# Altium schematic sheet MCU.SchDoc
size A3; SheetNumber: 3; SheetTotal: 5
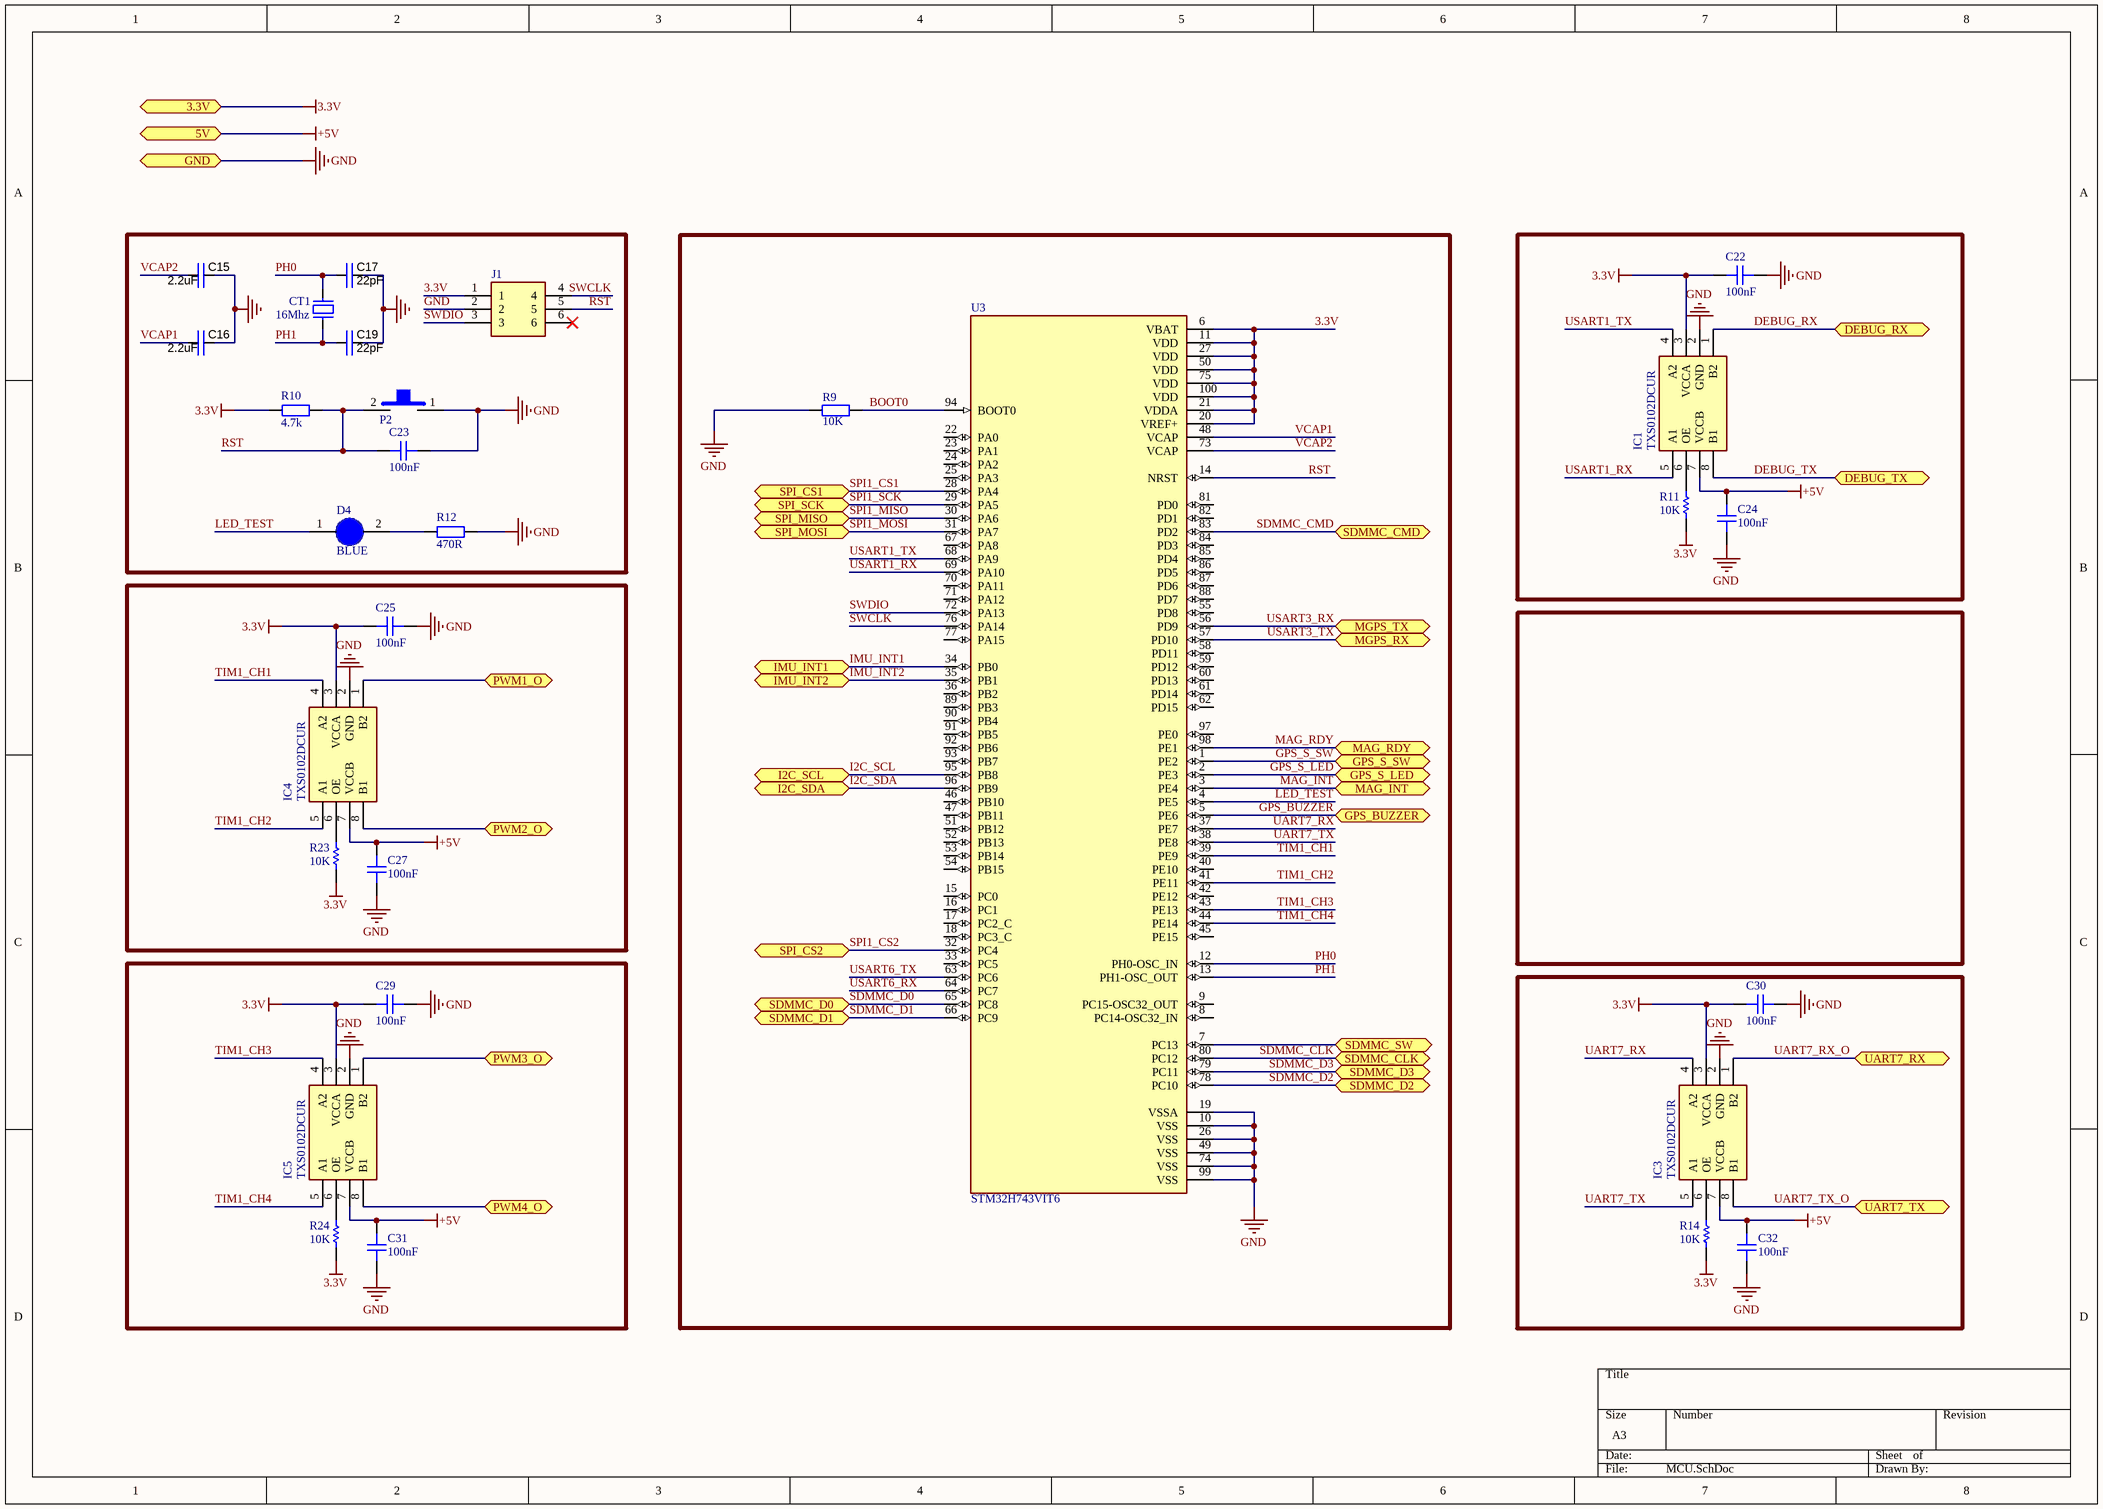
[diagram p0: MCU.SchDoc]

## Parts
C15  value 2.2uF  [CAPC-0402 (0506)]  (hidden comment: Tụ gốm)
C16  value 2.2uF  [CAPC-0402 (0506)]  (hidden comment: Tụ gốm)
C17  22pF  [CAPC-0402 (1005)]
C19  22pF  [CAPC-0402 (1005)]
C22  100nF  [CAP_0402]
C23  100nF  [CAP_0402]
C24  100nF  [CAP_0402]
C25  100nF  [CAP_0402]
C27  100nF  [CAP_0402]
C29  100nF  [CAP_0402]
C30  100nF  [CAP_0402]
C31  100nF  [CAP_0402]
C32  100nF  [CAP_0402]
CT1  16Mhz  [CRYSTAL-SMD5032]
D4  BLUE  [LED_0603_BLUE]
IC1  TXS0102DCUR  [TXS0102DCUR]
IC3  TXS0102DCUR  [TXS0102DCUR]
IC4  TXS0102DCUR  [TXS0102DCUR]
IC5  TXS0102DCUR  [TXS0102DCUR]
J1  SM06B-SRSS-TB__LF__SN_  [SM06B-SRSS-TB]  (value not drawn)
P2  (no value)  [SW 2P SMD]
R9  10K  [RESC-0402 (1005)]
R10  4.7k  [RESC-0402 (1005)]
R11  10K  [RESC-0402 (1005)]
R12  470R  [RESC-0402 (1005)]
R14  10K  [RESC-0402 (1005)]
R23  10K  [RESC-0402 (1005)]
R24  10K  [RESC-0402 (1005)]
U3  STM32H743VIT6  [QFP50P1600X1600X160-100N]

## Ports
3.3V (bidir), 5V (bidir), DEBUG_RX (bidir), DEBUG_TX (bidir), GND (bidir), GPS_BUZZER (bidir), GPS_S_LED (bidir), GPS_S_SW (bidir), I2C_SCL (bidir), I2C_SDA (bidir), IMU_INT1 (bidir), IMU_INT2 (bidir), MAG_INT (bidir), MAG_RDY (bidir), MGPS_RX (bidir), MGPS_TX (bidir), PWM1_O (bidir), PWM2_O (bidir), PWM3_O (bidir), PWM4_O (bidir), SDMMC_CLK (bidir), SDMMC_CMD (bidir), SDMMC_D0 (bidir), SDMMC_D1 (bidir), SDMMC_D2 (bidir), SDMMC_D3 (bidir), SDMMC_SW (bidir), SPI_CS1 (bidir), SPI_CS2 (bidir), SPI_MISO (bidir), SPI_MOSI (bidir), SPI_SCK (bidir), UART7_RX (bidir), UART7_TX (bidir)

## Nets
3.3V: C22.2 C25.2 C29.2 C30.2 IC1.3(VCCA) IC3.3(VCCA) IC4.3(VCCA) IC5.3(VCCA) J1.1 R10.2 R11.1 R14.1 R23.1 R24.1 U3.6(VBAT) U3.11(VDD) U3.20(VREF+) U3.21(VDDA) U3.27(VDD) U3.50(VDD) U3.75(VDD) U3.100(VDD) ; port 3.3V
+5V: C24.2 C27.2 C31.2 C32.2 IC1.7(VCCB) IC3.7(VCCB) IC4.7(VCCB) IC5.7(VCCB) ; port 5V
GND: C15.2 C16.2 C17.2 C19.2 C22.1 C23.1 C24.1 C25.1 C27.1 C29.1 C30.1 C31.1 C32.1 IC1.2(GND) IC3.2(GND) IC4.2(GND) IC5.2(GND) J1.2 P2.1 R9.1 R12.1 U3.10(VSS) U3.19(VSSA) U3.26(VSS) U3.49(VSS) U3.74(VSS) U3.99(VSS) ; port GND
BOOT0: R9.2 U3.94(BOOT0)
DEBUG_RX: IC1.1(B2) ; port DEBUG_RX
DEBUG_TX: IC1.8(B1) ; port DEBUG_TX
GPS_BUZZER: U3.5(PE6) ; port GPS_BUZZER
GPS_S_LED: U3.2(PE3) ; port GPS_S_LED
GPS_S_SW: U3.1(PE2) ; port GPS_S_SW
I2C_SCL: U3.95(PB8) ; port I2C_SCL
I2C_SDA: U3.96(PB9) ; port I2C_SDA
IMU_INT1: U3.34(PB0) ; port IMU_INT1
IMU_INT2: U3.35(PB1) ; port IMU_INT2
LED_TEST: D4.1(A) U3.4(PE5)
MAG_INT: U3.3(PE4) ; port MAG_INT
MAG_RDY: U3.98(PE1) ; port MAG_RDY
PH0: C17.1 CT1.2 U3.12(PH0-OSC_IN)
PH1: C19.1 CT1.1 U3.13(PH1-OSC_OUT)
PWM1_O: IC4.1(B2) ; port PWM1_O
PWM2_O: IC4.8(B1) ; port PWM2_O
PWM3_O: IC5.1(B2) ; port PWM3_O
PWM4_O: IC5.8(B1) ; port PWM4_O
RST: C23.2 J1.5 P2.2 R10.1 U3.14(NRST)
SDMMC_CLK: U3.80(PC12) ; port SDMMC_CLK
SDMMC_CMD: U3.83(PD2) ; port SDMMC_CMD
SDMMC_D0: U3.65(PC8) ; port SDMMC_D0
SDMMC_D1: U3.66(PC9) ; port SDMMC_D1
SDMMC_D2: U3.78(PC10) ; port SDMMC_D2
SDMMC_D3: U3.79(PC11) ; port SDMMC_D3
SDMMC_SW: U3.7(PC13) ; port SDMMC_SW
SPI1_CS1: U3.28(PA4) ; port SPI_CS1
SPI1_CS2: U3.32(PC4) ; port SPI_CS2
SPI1_MISO: U3.30(PA6) ; port SPI_MISO
SPI1_MOSI: U3.31(PA7) ; port SPI_MOSI
SPI1_SCK: U3.29(PA5) ; port SPI_SCK
SWCLK: J1.4 U3.76(PA14)
SWDIO: J1.3 U3.72(PA13)
TIM1_CH1: IC4.4(A2) U3.39(PE9)
TIM1_CH2: IC4.5(A1) U3.41(PE11)
TIM1_CH3: IC5.4(A2) U3.43(PE13)
TIM1_CH4: IC5.5(A1) U3.44(PE14)
UART7_RX: IC3.4(A2) U3.37(PE7)
UART7_RX_O: IC3.1(B2) ; port UART7_RX
UART7_TX: IC3.5(A1) U3.38(PE8)
UART7_TX_O: IC3.8(B1) ; port UART7_TX
USART1_RX: IC1.5(A1) U3.69(PA10)
USART1_TX: IC1.4(A2) U3.68(PA9)
USART3_RX: U3.56(PD9) ; port MGPS_TX
USART3_TX: U3.57(PD10) ; port MGPS_RX
USART6_RX: U3.64(PC7)
USART6_TX: U3.63(PC6)
VCAP1: C16.1 U3.48(VCAP)
VCAP2: C15.1 U3.73(VCAP)
NetD4_2: D4.2(K) R12.2
NetIC1_6: IC1.6(OE) R11.2
NetIC3_6: IC3.6(OE) R14.2
NetIC4_6: IC4.6(OE) R23.2
NetIC5_6: IC5.6(OE) R24.2

Not connected (* = marked no-connect by the designer): J1 6*; U3 8(PC14-OSC32_IN) 9(PC15-OSC32_OUT) 15(PC0) 16(PC1) 17(PC2_C) 18(PC3_C) 22(PA0) 23(PA1) 24(PA2) 25(PA3) 33(PC5) 36(PB2) 40(PE10) 42(PE12) 45(PE15) 46(PB10) 47(PB11) 51(PB12) 52(PB13) 53(PB14) 54(PB15) 55(PD8) 58(PD11) 59(PD12) 60(PD13) 61(PD14) 62(PD15) 67(PA8) 70(PA11) 71(PA12) 77(PA15) 81(PD0) 82(PD1) 84(PD3) 85(PD4) 86(PD5) 87(PD6) 88(PD7) 89(PB3) 90(PB4) 91(PB5) 92(PB6) 93(PB7) 97(PE0)

## Library data of the parts
C15-C17 C19 = CAP C_0603: Capacitor SMD Cer 470nF 10% 16V X7R 0603; Manufacturer 1: Murata Electronics North America; Manufacturer Part Number 1: GRM188R71C474KA88D; Ratings: 16V; X7R; Material: ceramic; SCDType: spec; Package / Case: 0603 (1608 metric); Tolerance: ±10%; Manufacturer 2: TDK Corporation; Manufacturer Part Number 2: C1608X7R1C474K; Supplier 1: Digi-Key; Supplier Part Number 1: 490-3295-2-ND; Supplier 2: Digi-Key; Supplier Part Number 2: 445-5192-2-ND; Supplier 3: Digi-Key; Supplier Part Number 3: 587-1250-2-ND; Manufacturer 3: Taiyo Yuden; Manufacturer Part Number 3: EMK107B7474KA-T; Manufacturer 4: Samsung; Manufacturer Part Number 4: CL10B474KONE; ComponentLink1URL: http://psearch.murata.com/capacitor/product/GRM188R71C474KA88#.pdf; ComponentLink1Description: http://psearch.murata.com/capacitor/product/GRM188R71C474KA88#.pdf; ComponentLink2URL: http://product.tdk.com/capacitor/mlcc/en/documents/mlcc_commercial_general_en.pdf; ComponentLink2Description: http://product.tdk.com/capacitor/mlcc/en/documents/mlcc_commercial_general_en.pdf; ComponentLink3URL: http://www.yuden.co.jp/or/product/category/capacitor/EMK107B7474KA-T.pdf; ComponentLink3Description: http://www.yuden.co.jp/or/product/category/capacitor/EMK107B7474KA-T.pdf
  C17 C19: Value: 22pF
C22-C25 C27 C29-C32 = CAP_0402: 0402 100nF 16V X7R; Manufacturer: *; Manufacturer Part Number: *; Distributor Link: *; LCSC: *; Rating: *; Dielectric: *
CT1 = CRYSTAL: CL = 16 - 18pF; Value: 4Mhz
D4 = LED BLUE 0603: LED BLUE 0603 SMD; Solder: SMT; Value: BLUE; Category: *
IC1 IC3-IC5 = TXS0102DCUR: Integrated Circuit; Manufacturer_Name: Texas Instruments; Datasheet Link: https://datasheet.datasheetarchive.com/originals/distributors/SFDatasheet-7/sf-000145437.pdf; Height: 0.9mm; Manufacturer_Part_Number: TXS0102DCUR; Mouser Part Number: 595-TXS0102DCUR; Mouser Price/Stock: https://www.mouser.co.uk/ProductDetail/Texas-Instruments/TXS0102DCUR?qs=dB0LedT%252BmmBcQ3I%2Fs9XEDA%3D%3D; Arrow Part Number: TXS0102DCUR; Arrow Price/Stock: https://www.arrow.com/en/products/txs0102dcur/texas-instruments?region=nac
J1 = SM06B-SRSS-TB__LF__SN_: Connector; Manufacturer_Name: JST (JAPAN SOLDERLESS TERMINALS); Manufacturer_Part_Number: SM06B-SRSS-TB (LF)(SN); Datasheet Link: http://uk.rs-online.com/web/p/products/5468827
P2 = Button 2 SMD: SMD Mini Push Button Switch 2 Pin 3x6x2.7mm; MPN: SMD Mini Push Button 2 SMD; Link: https://ram-e-shop.com/product/press2pin-smd/
R9 = RC0603FR-0710KL: RES SMD 10K OHM 1% 1/10W 0603; CompanyID: VT-00328; Solder: SMT; MPN: RC0603FR-0710KL; Value: 10K; Category: RESISTOR
R10 = Tro 0603 5% 4.7k: Dán; Don_Vi: Con; So_Chan: 2; Ten_Linh_Kien: Trở 0603 5% 4.7k; Ma_Hang: MH006327; Chung_Loai: Dán; Kieu_Chan: *
R11 R14 R23 R24 = Res Semi: Semiconductor Resistor; Value: 1K; Published: 8-Jun-2000; LatestRevisionDate: 17-Jul-2002; LatestRevisionNote: Re-released for DXP Platform.; PackageReference: AXIAL-0.5; Publisher: Altium Limited; PackageDescription: Axial Device, Thru-Hole; 2 Leads; 0.5 in Pin Spacing
R12 = Tro 0603 5% 470R: Dán; Don_Vi: Con; So_Chan: 2; Ten_Linh_Kien: Trở 0603 5% 470R; Ma_Hang: MH006328; Chung_Loai: Dán; Kieu_Chan: *
U3 = STM32H743VIT6: ARMÂ® CortexÂ®-M7 STM32H7 Microcontroller IC 32-Bit Single-Core 480MHz 2MB (2M x 8) FLASH 100-LQFP (14x14); MF: STMicroelectronics; SnapEDA_Link: https://www.snapeda.com/parts/STM32H743VIT6/STMicroelectronics/view-part/?ref=snap; Package: LQFP-100 STMicroelectronics; Value: *; MP: STM32H743VIT6; Check_prices: https://www.snapeda.com/parts/STM32H743VIT6/STMicroelectronics/view-part/?ref=eda